# EAGLE design Arm (EAGLE 9.6.2)
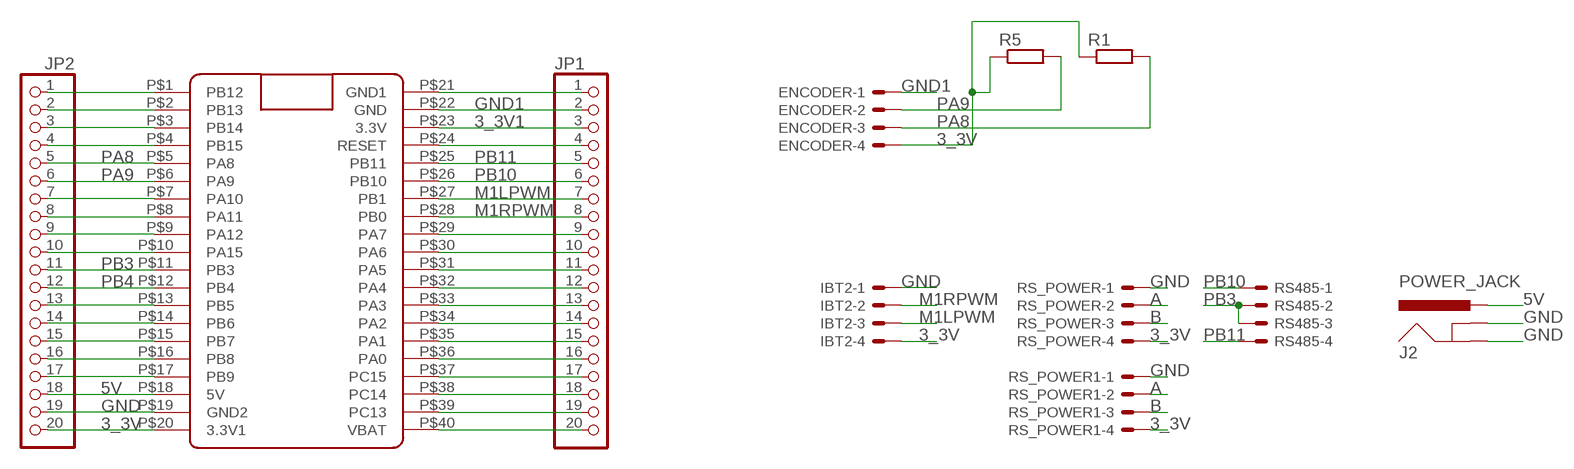
[diagram p0: schematic, sheet 1]

## Parts
ENCODER  JST-XH-04-PIN-LONG-PAD  [JST-XH-04-PACKAGE-LONG-PAD]
IBT2  JST-XH-04-PIN-LONG-PAD  [JST-XH-04-PACKAGE-LONG-PAD]
J2  POWER_JACK  [POWER_JACK]
JP1  PINHD-1X20  [1X20]
JP2  PINHD-1X20  [1X20]
R1  R-EU_0207/10  [0207/10]
R5  R-EU_0207/10  [0207/10]
RS485  JST-XH-04-PIN-LONG-PAD  [JST-XH-04-PACKAGE-LONG-PAD]
RS_POWER  JST-XH-04-PIN-LONG-PAD  [JST-XH-04-PACKAGE-LONG-PAD]
RS_POWER1  JST-XH-04-PIN-LONG-PAD  [JST-XH-04-PACKAGE-LONG-PAD]
U$1  BLUE_PILL  [BLUE_PILL]

## Nets
3_3V: ENCODER.4 IBT2.4 JP2.20 R1.1 R5.1 RS_POWER1.4 RS_POWER.4 U$1.P$20(3.3V1)
3_3V1: JP1.3 U$1.P$23(3.3V)
5V: J2.PWR JP2.18 U$1.P$18(5V)
A: RS_POWER1.2 RS_POWER.2
B: RS_POWER1.3 RS_POWER.3
GND: IBT2.1 J2.GNDBREAK JP2.19 RS_POWER1.1 RS_POWER.1 U$1.P$19(GND2)
GND1: ENCODER.1 JP1.2 U$1.P$22(GND)
M1LPWM: IBT2.3 JP1.7 U$1.P$27(PB1)
M1RPWM: IBT2.2 JP1.8 U$1.P$28(PB0)
N$1: JP1.1 U$1.P$21(GND1)
N$4: JP1.4 U$1.P$24(RESET)
N$5: JP1.9 U$1.P$29(PA7)
N$6: J2.GND
N$7: JP1.10 U$1.P$30(PA6)
N$8: JP2.14 U$1.P$14(PB6)
N$9: JP2.15 U$1.P$15(PB7)
N$11: JP1.11 U$1.P$31(PA5)
N$12: JP1.12 U$1.P$32(PA4)
N$13: JP1.13 U$1.P$33(PA3)
N$14: JP1.14 U$1.P$34(PA2)
N$15: JP1.15 U$1.P$35(PA1)
N$16: JP1.16 U$1.P$36(PA0)
N$17: JP1.17 U$1.P$37(PC15)
N$18: JP1.18 U$1.P$38(PC14)
N$19: JP1.19 U$1.P$39(PC13)
N$20: JP1.20 U$1.P$40(VBAT)
N$21: JP2.1 U$1.P$1(PB12)
N$22: JP2.2 U$1.P$2(PB13)
N$23: JP2.3 U$1.P$3(PB14)
N$24: JP2.4 U$1.P$4(PB15)
N$27: JP2.7 U$1.P$7(PA10)
N$28: JP2.8 U$1.P$8(PA11)
N$29: JP2.9 U$1.P$9(PA12)
N$30: JP2.10 U$1.P$10(PA15)
N$33: JP2.13 U$1.P$13(PB5)
N$36: JP2.16 U$1.P$16(PB8)
N$37: JP2.17 U$1.P$17(PB9)
PA8: ENCODER.3 JP2.5 R1.2 U$1.P$5(PA8)
PA9: ENCODER.2 JP2.6 R5.2 U$1.P$6(PA9)
PB3: JP2.11 RS485.2 RS485.3 U$1.P$11(PB3)
PB4: JP2.12 U$1.P$12(PB4)
PB10: JP1.6 RS485.1 U$1.P$26(PB10)
PB11: JP1.5 RS485.4 U$1.P$25(PB11)

## Library data of the parts
ENCODER IBT2 RS485 RS_POWER RS_POWER1 = JST:JST-XH-04-PIN: JST XH Connector 2 Pin Wire to board connector. Pitch: 2,54 mm, (0.100") Number of pins: 4 Created by Rembrandt Electronics www.rembrandtelectronics.com
J2 = J-Generic-5.5mm-Barrel-Jack:POWER_JACK: Power Jack Connector This is the standard 5.5mm barrel jack for power. The PTH is the most common, proven, reliable, footprint. The Slot footprint only works if the mill layer is transmitted to the PCB fab house so be warned. Here are the connectors we sell at SparkFun: DC Barrel Power Jack/Connector <https://www.sparkfun.com/products/119> (PRT-00119) DC Barrel Power Jack/Connector (SMD) <https://www.sparkfun.com/products/12748> (PRT-12748) DC Barrel Jack Adapter - Breadboard Compatible <https://www.sparkfun.com/products/10811> (PRT-10811) It is used on this SparkFun product (and many, many others): SparkFun RedBoard - Programmed with Arduino <https://www.sparkfun.com/products/12757> (DEV-12757) Also, if you need a mating power supply or connector, please check these out: Wall Adapter Power Supply - 9VDC 650mA <https://www.sparkfun.com/products/298> (TOL-00298) DC Barrel Jack Adapter - Male <https://www.sparkfun.com/products/10287> (PRT-10287); DPN: CP-202A-ND; MPN: PJ-202A
JP1 JP2 = pinhead:PINHD-1X20: PIN HEADER
R1 R5 = rcl:R-EU_: RESISTOR, European symbol; SPICEPREFIX: R
U$1 = BluePill:BLUE_PILL

## Net classes
0 default: width 0.3 mm, drill 0.203 mm, clearance 0.3 mm

## Board
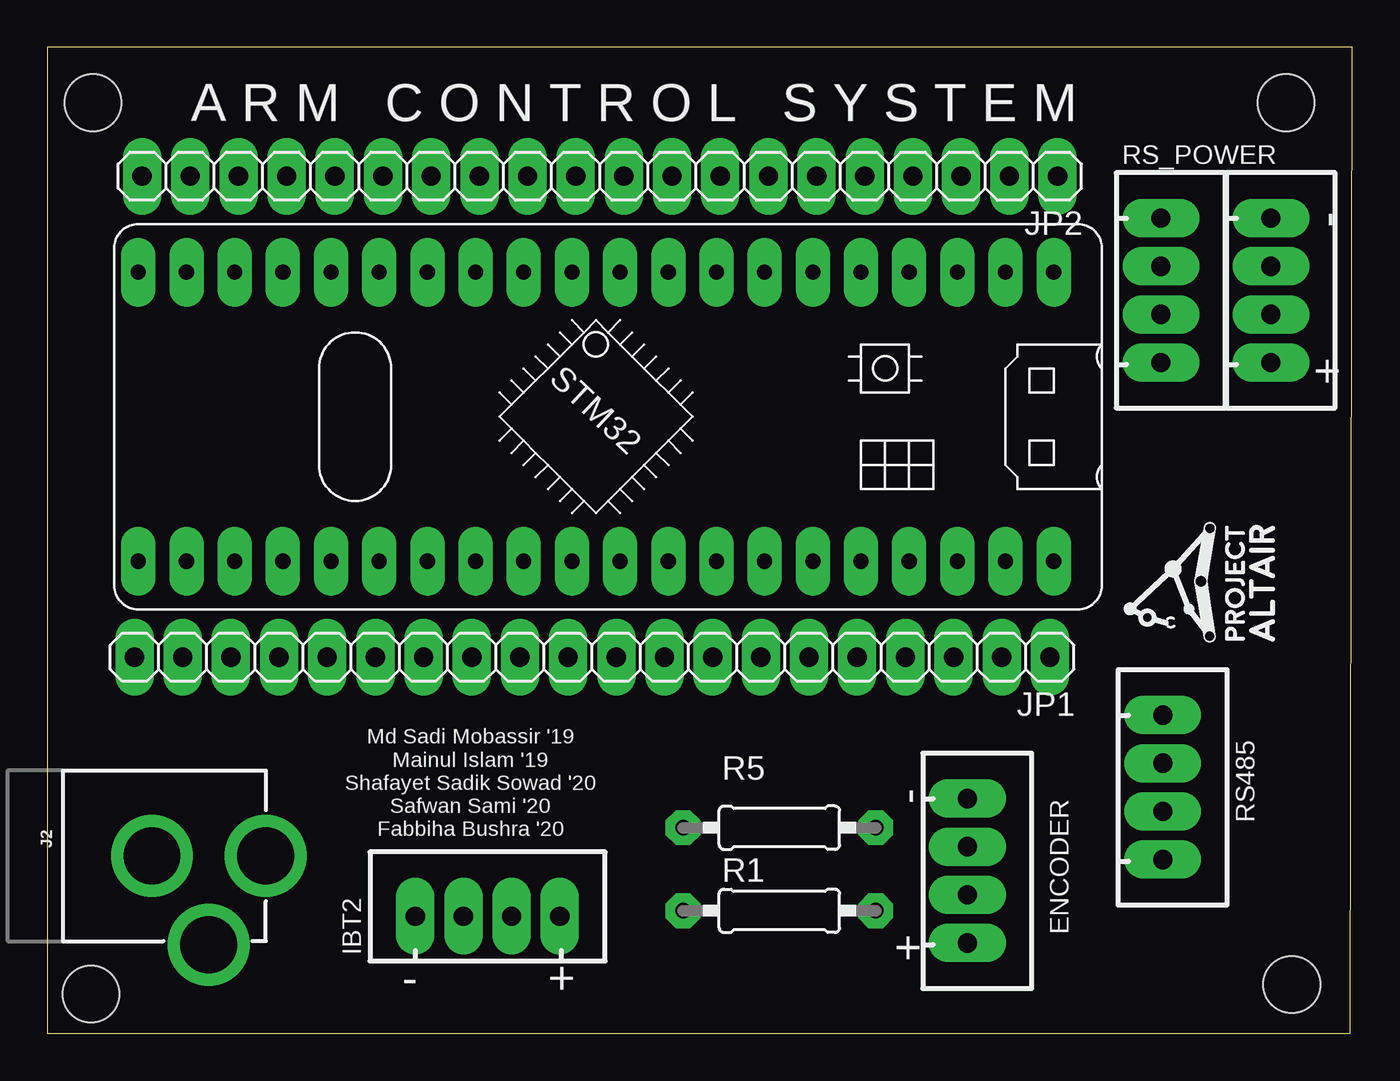
[diagram p1: board, top side]
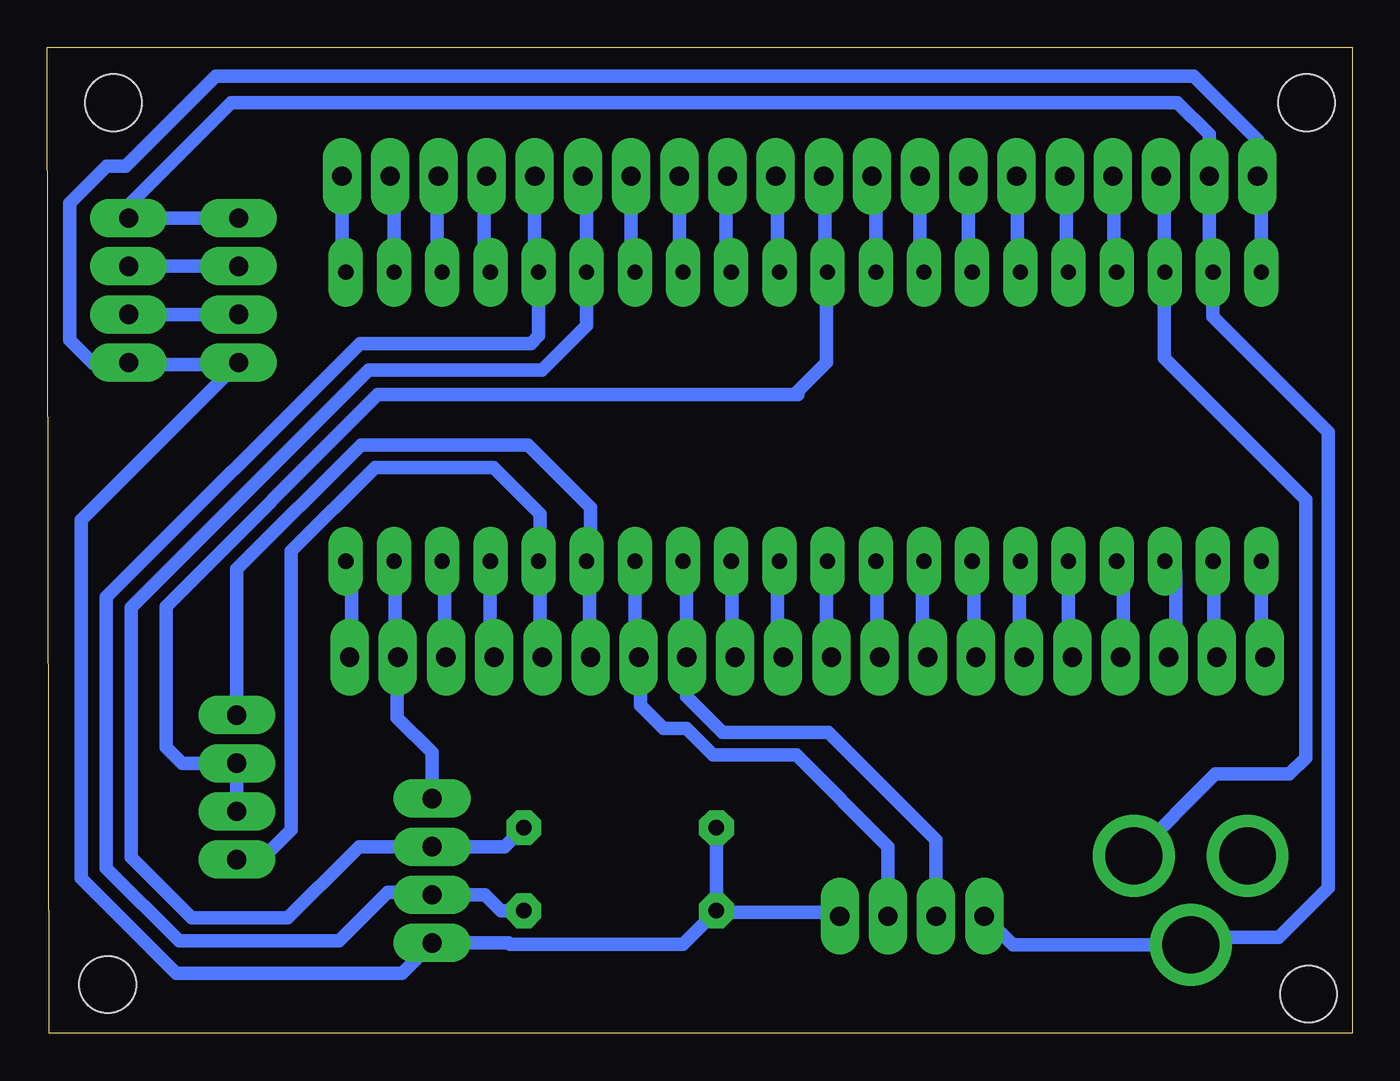
[diagram p2: board, bottom side, seen from below]

Size 68.78 x 51.99 mm. Coordinates in mm from the lower left corner, seen from the top.
Outline: 0,0 68.68,0 68.78,51.99 0,51.99 0,0
Copper layers (1*16): Top 0.035mm / dielectric 1.5mm / Bottom 0.035mm
Design rules "default *": minimum track width 0.7mm, minimum drill 0.65mm, track to track 0.5mm, track to pad 0.5mm, pad to pad 0.5mm, via to via 0.5mm, smd to smd 10mil, copper to edge 0.7mm, drill to drill 15mil, minimum pad ring 20mil, minimum via ring 20mil, stop-mask expansion 4mil, vias tented up to drill 0mil, thermal gap 10mil
Holes 3 mm at 2.3,2.08 65.3,49.08 2.4,49.08 65.6,2.58

### Footprints (pad centres in the part's own frame; a part is rotated, then mirrored left to right if it is on the bottom)
JST-XH-04-PACKAGE-LONG-PAD = drill 1.016 long: 1 -3.81,0; 2 -1.27,0; 3 1.27,0; 4 3.81,0
POWER_JACK = drill 2.997 pad 4.318: GND 0,7.7; GNDBREAK 4.7,10.7; PWR 0,13.7
1X20 = drill 1.016 long: 1 -24.13,0; 2 -21.59,0; 3 -19.05,0; 4 -16.51,0; 5 -13.97,0; 6 -11.43,0; 7 -8.89,0; 8 -6.35,0; 9 -3.81,0; 10 -1.27,0; 11 1.27,0; 12 3.81,0; 13 6.35,0; 14 8.89,0; 15 11.43,0; 16 13.97,0; 17 16.51,0; 18 19.05,0; 19 21.59,0; 20 24.13,0
0207/10 = drill 0.813 octagon: 1 -5.08,0; 2 5.08,0
BLUE_PILL = drill 0.8 long: P$1 -7.62,15.24; P$2 -7.62,12.7; P$3 -7.62,10.16; P$4 -7.62,7.62; P$5 -7.62,5.08; P$6 -7.62,2.54; P$7 -7.62,0; P$8 -7.62,-2.54; P$9 -7.62,-5.08; P$10 -7.62,-7.62; P$11 -7.62,-10.16; P$12 -7.62,-12.7; P$13 -7.62,-15.24; P$14 -7.62,-17.78; P$15 -7.62,-20.32; P$16 -7.62,-22.86; P$17 -7.62,-25.4; P$18 -7.62,-27.94; P$19 -7.62,-30.48; P$20 -7.62,-33.02; P$21 7.62,15.24; P$22 7.62,12.7; P$23 7.62,10.16; P$24 7.62,7.62; P$25 7.62,5.08; P$26 7.62,2.54; P$27 7.62,0; P$28 7.62,-2.54; P$29 7.62,-5.08; P$30 7.62,-7.62; P$31 7.62,-10.16; P$32 7.62,-12.7; P$33 7.62,-15.24; P$34 7.62,-17.78; P$35 7.62,-20.32; P$36 7.62,-22.86; P$37 7.62,-25.4; P$38 7.62,-27.94; P$39 7.62,-30.48; P$40 7.62,-33.02

### Placement (x,y rotation side)
ENCODER  48.5,8.58 270 top
IBT2  23.2,6.18 0 top
J2  -2.19,9.37 270 top
JP1  28.72,19.84 180 top
JP2  29.12,45.2 180 top
R1  38.59,6.47 0 top
R5  38.59,10.85 0 top
RS485  58.8,12.98 270 top
RS_POWER  58.7,39.18 270 top
RS_POWER1  64.5,39.18 270 top
U$1  37.81,32.52 270 top
U$3  ALTAIR_SMALL  [ALTAIR_SMALL]  65.3,20.08 90 top

### Tracks (layer width: path | path; a pad name or v marks a point on that pad's centre or on a via)
3_3V
  Bottom 0.7: U$1.P$20 4.79,45.19 JP2.20 4.96,45.23 4.96,47.09 8.36,50.48 59.9,50.48 64.65,45.73 65.65,45.73 67.6,43.78 67.6,36.55 66.39,35.34 66.36,35.37 RS_POWER1.4 64.4,35.27 58.8,35.27 RS_POWER.4 67,27.07 67,8.18 62,3.18 50.09,3.18 ENCODER.4 44.46,4.77 44.4,4.71 35.27,4.71 R1.1 | R5.1 R1.1 | IBT2.4 27.21,6.38 33.42,6.38 R1.1
3_3V1
  Bottom 0.7: JP1.3 47.85,19.92 47.85,24.8 U$1.P$23
5V
  Bottom 0.7: JP2.18 9.9,44.67 9.9,40.17 U$1.P$18 9.89,40.12 9.89,35.6 2.45,28.17 2.45,14.53 3.3,13.68 7.2,13.68 J2.PWR
A
  Bottom 0.7: RS_POWER.2 RS_POWER1.2
B
  Bottom 0.7: RS_POWER1.3 RS_POWER.3
GND
  Bottom 0.7: IBT2.1 17.88,4.67 J2.GNDBREAK 8.12,5.06 3.86,5.06 1.25,7.67 1.25,31.71 7.33,37.79 U$1.P$19 7.53,40.34 JP2.19 7.53,47.41 9.2,49.08 59.1,49.08 64.5,43.68 RS_POWER1.1 RS_POWER.1
GND1
  Bottom 0.7: U$1.P$22 50.45,24.8 50.45,19.98 JP1.2 50.34,19.84 50.34,16.65 48.5,14.81 ENCODER.1
M1LPWM
  Bottom 0.7: U$1.P$27 37.81,20.04 JP1.7 37.51,19.74 37.51,17.29 36.3,16.08 35.1,16.08 33.7,14.68 29.3,14.68 24.47,9.85 IBT2.3
M1RPWM
  Bottom 0.7: U$1.P$28 35.1,24.73 35.1,19.87 | JP1.8 35.1,19.87 | IBT2.2 21.93,10.21 27.6,15.88 33.2,15.88 35.1,17.78 35.1,19.87
N$1
  Bottom 0.7: U$1.P$21 52.75,24.6 52.75,19.94 JP1.1
N$4
  Bottom 0.7: JP1.4 45.45,20.06 45.45,24.88 U$1.P$24
N$5
  Bottom 0.7: JP1.9 32.7,20.01 32.7,24.87 U$1.P$29
N$7
  Bottom 0.7: JP1.10 30.3,20.15 30.3,24.79 U$1.P$30
N$8
  Bottom 0.7: U$1.P$14 20.23,40.34 JP2.14
N$9
  Bottom 0.7: U$1.P$15 17.65,40.3 17.65,45.05 JP2.15
N$11
  Bottom 0.7: JP1.11 27.7,20.09 27.7,24.85 U$1.P$31
N$12
  Bottom 0.7: JP1.12 25.05,19.98 25.05,24.83 U$1.P$32
N$13
  Bottom 0.7: JP1.13 22.65,20.12 22.65,24.82 U$1.P$33
N$14
  Bottom 0.7: JP1.14 19.95,19.96 19.95,24.62 U$1.P$34
N$15
  Bottom 0.7: JP1.15 17.55,20.1 17.55,24.84 U$1.P$35
N$16
  Bottom 0.7: U$1.P$36 14.95,20.04 JP1.16
N$17
  Bottom 0.7: U$1.P$37 12.05,24.72 12.05,19.94 JP1.17
N$18
  Bottom 0.7: U$1.P$38 9.3,24.33 9.3,20.32 JP1.18
N$19
  Bottom 0.7: JP1.19 7.3,20.01 7.3,24.83 U$1.P$39
N$20
  Bottom 0.7: U$1.P$40 4.79,20.2 4.76,20 4.75,20 JP1.20
N$21
  Bottom 0.7: JP2.1 53.25,40.34 U$1.P$1
N$22
  Bottom 0.7: JP2.2 50.65,45.14 50.65,44.97 50.51,44.95 U$1.P$2
N$23
  Bottom 0.7: JP2.3 48.25,45.12 48.25,40.42 U$1.P$3
N$24
  Bottom 0.7: U$1.P$4 45.75,40.46 45.75,45.08 JP2.4
N$27
  Bottom 0.7: JP2.7 38.01,40.34 U$1.P$7
N$28
  Bottom 0.7: U$1.P$8 35.47,40.34 JP2.8
N$29
  Bottom 0.7: JP2.9 33,45.13 33,40.41 U$1.P$9
N$30
  Bottom 0.7: U$1.P$10 30.3,40.25 30.3,45.02 JP2.10
N$33
  Bottom 0.7: U$1.P$13 22.77,40.34 JP2.13
N$36
  Bottom 0.7: U$1.P$16 15.05,40.24 15.05,44.98 JP2.16
N$37
  Bottom 0.7: U$1.P$17 12.55,40.28 12.55,45.11 JP2.17
PA8
  Bottom 0.7: JP2.5 43.1,40.35 U$1.P$5 42.89,36.79 43.3,36.38 52.3,36.38 65.68,23 65.68,8.71 61.84,4.88 53.41,4.88 50.85,7.43 48.62,7.43 ENCODER.3 45.71,7.31 44.87,6.47 R1.2
PA9
  Bottom 0.7: R5.2 44.67,9.85 ENCODER.2 52.35,9.85 52.72,9.48 56.11,6.09 61.17,6.09 64.36,9.28 64.36,22.47 51.86,34.98 42.7,34.98 40.35,37.33 U$1.P$6 40.35,45 JP2.6
PB3
  Bottom 0.7: JP2.11 27.8,45.13 27.8,40.29 U$1.P$11 27.7,40.09 27.7,35.38 29.2,33.88 29.2,33.68 51.36,33.68 62.52,22.52 62.52,15.08 61.69,14.25 RS485.2 RS485.3
PB4
  Bottom 0.7: U$1.P$12 25.11,45 JP2.12
PB10
  Bottom 0.7: JP1.6 40.2,19.89 40.2,24.69 U$1.P$26 40.15,25.1 40.15,27.74 43.45,31.03 52.25,31.03 58.8,24.49 RS485.1
PB11
  Bottom 0.7: 42.8,24.83 42.8,19.95 JP1.5 | 42.8,24.83 U$1.P$25 | RS485.4 58.77,9.14 57.51,9.14 55.92,10.74 55.92,25.43 51.51,29.84 45.25,29.84 42.8,27.38 42.8,24.83

### Text on the board
tNames: A R M C O N T R O L S Y S T E M | + - | Md Sadi Mobassir '19 / Mainul Islam '19 / Shafayet Sadik Sowad '20 / Safwan Sami '20 / Fabbiha Bushra '20 | + - | - +